# Altium schematic sheet Liniar Power Source.SchDoc
size A4; SheetNumber: 1; SheetTotal: 1
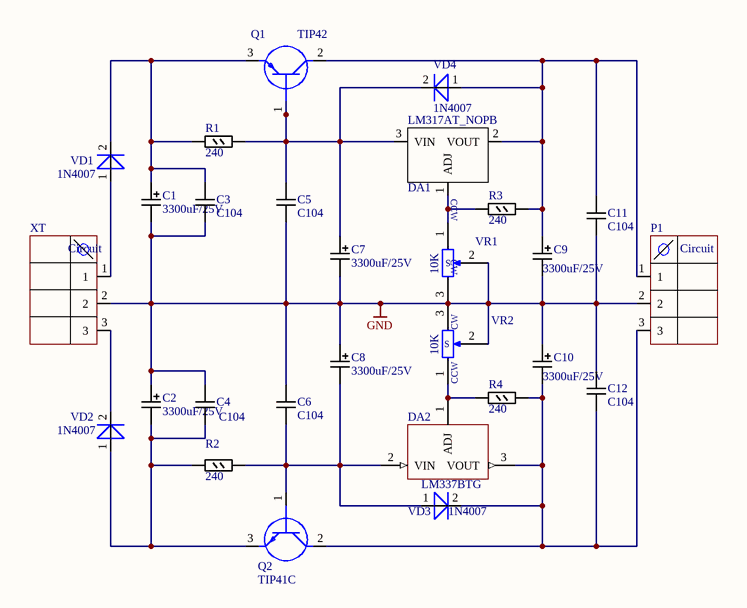
[diagram p0: Liniar Power Source.SchDoc]

## Parts
C1  3300uF/25V  [Cap electrolitic radial 16x25 B]
C2  3300uF/25V  [Cap electrolitic radial 16x25 B]
C3  C104  [CAP CER 5x3x75mm]
C4  C104  [CAP CER 5x3x75mm]
C5  C104  [CAP CER 5x3x75mm]
C6  C104  [CAP CER 5x3x75mm]
C7  3300uF/25V  [Cap electrolitic radial 16x25 B]
C8  3300uF/25V  [Cap electrolitic radial 16x25 B]
C9  3300uF/25V  [Cap electrolitic radial 16x25 B]
C10  3300uF/25V  [Cap electrolitic radial 16x25 B]
C11  C104  [CAP CER 5x3x75mm]
C12  C104  [CAP CER 5x3x75mm]
DA1  LM317AT_NOPB  [TO254P470X1028X1955-3P]
DA2  LM337BTG  [TO254P482X997X2018-3P]
P1  DG350-3.5-3  [DG350-3.5-3]  (value not drawn)
Q1  TIP42  [TO254P483X1010X2035-3P]
Q2  TIP41C  [TO254P483X1010X2035-3P]
R1  240  [RESC2012(0805)N]
R2  240  [RESC2012(0805)N]
R3  240  [RESC2012(0805)N]
R4  240  [RESC2012(0805)N]
VD1  1N4007  [DO-35]
VD2  1N4007  [DO-35]
VD3  1N4007  [DO-35]
VD4  1N4007  [DO-35]
VR1  10K  [P160KN0QC15B50K]
VR2  10K  [P160KN0QC15B50K]
XT  DG350-3.5-3  [DG350-3.5-3]  (value not drawn)

## Nets
GND: C1.2 C2.1 C3.1 C4.2 C5.1 C6.2 C7.2 C8.1 C9.2 C10.1 C11.1 C12.2 P1.2 VR1.3(CW) VR2.3(CW) XT.2
NetC1_1: C1.1 C3.2 Q1.3(E) R1.1 VD1.2
NetC2_2: C2.2 C4.1 Q2.3(E) R2.1 VD2.1
NetC5_2: C5.2 C7.1 DA1.3(VIN) Q1.1(B) R1.2 VD4.2
NetC6_1: C6.1 C8.2 DA2.2(VIN) Q2.1(B) R2.2 VD3.1
NetC9_1: C9.1 C11.2 DA1.2(VOUT) P1.1 Q1.2(C) R3.2 VD4.1
NetC10_2: C10.2 C12.1 DA2.3(VOUT) P1.3 Q2.2(C) R4.2 VD3.2
NetDA1_1: DA1.1(ADJ) R3.1 VR1.1(CCW)
NetDA2_1: DA2.1(ADJ) R4.1 VR2.1(CCW)
NetVD1_1: VD1.1 XT.1
NetVD2_2: VD2.2 XT.3

Not connected (* = marked no-connect by the designer): VR1 2(S); VR2 2(S)

## Notes on the sheet
- (in symbol DG350-3.5-3) Circuit

## Library data of the parts
C1 C2 C7-C10 = Cap electrolitic radial 16x25: Part Number: Cap electrolitic radial 16x25
C3-C6 C11 C12 = CAP CER RADIAL: Part Number: CAP CER RADIAL
DA1 = LM317AT_NOPB: Integrated Circuit; Manufacturer_Name: Texas Instruments; Manufacturer_Part_Number: LM317AT/NOPB; Datasheet Link: http://www.ti.com/lit/gpn/lm317a; Height: 4.7mm; Mouser Part Number: 926-LM317AT/NOPB; Mouser Price/Stock: https://www.mouser.co.uk/ProductDetail/Texas-Instruments/LM317AT-NOPB?qs=X1J7HmVL2ZFYFJRcNgsWcQ%3D%3D; Arrow Part Number: LM317AT/NOPB; Arrow Price/Stock: https://www.arrow.com/en/products/lm317atnopb/texas-instruments; Part Number: LM317AT_NOPB
DA2 = LM337BTG: Integrated Circuit; Manufacturer_Name: ON Semiconductor; Datasheet Link: http://www.onsemi.com/pub/Collateral/LM337-D.PDF; Height: 4.82mm; Manufacturer_Part_Number: LM337BTG; Mouser Part Number: 863-LM337BTG; Mouser Price/Stock: https://www.mouser.co.uk/ProductDetail/ON-Semiconductor/LM337BTG?qs=2OtswVQKCOGoOfwNKxF%2F1w%3D%3D; Arrow Part Number: LM337BTG; Arrow Price/Stock: https://www.arrow.com/en/products/lm337btg/on-semiconductor; Part Number: LM337BTG
Q1 = TIP42: Transistor BJT PNP; Manufacturer_Name: ON Semiconductor; Datasheet Link: http://www.onsemi.com/pub/Collateral/TIP41A-D.PDF; Height: 4.83mm; Manufacturer_Part_Number: TIP42; Mouser Part Number: 512-TIP42; Mouser Price/Stock: https://www.mouser.co.uk/ProductDetail/ON-Semiconductor-Fairchild/TIP42?qs=ljbEvF4DwOPva3Veot79WQ%3D%3D
Q2 = TIP41C: Transistor BJT NPN; Manufacturer_Name: ON Semiconductor; Datasheet Link: http://www.onsemi.com/pub/Collateral/TIP41A-D.PDF; Height: 4.83mm; Manufacturer_Part_Number: TIP41C; Mouser Part Number: 512-TIP41C; Mouser Price/Stock: https://www.mouser.co.uk/ProductDetail/ON-Semiconductor-Fairchild/TIP41C?qs=ljbEvF4DwONP6g8z%252BtNuIA%3D%3D; Arrow Part Number: TIP41C; Arrow Price/Stock: https://www.arrow.com/en/products/tip41c/on-semiconductor
R1-R4 = RESC2012(0805): Part Number: RESC2012(0805); Package: 0805
VD1-VD4 = 1N4148: Small Signal Diode; Part Number: 1N4148
VR1 VR2 = P160KN-0QC15B50K: Variable Resistor; Manufacturer_Name: BI Technologies; Datasheet Link: https://componentsearchengine.com/Datasheets/1/P160KN-0QC15B50K.pdf; Height: 20.75mm; Manufacturer_Part_Number: P160KN-0QC15B50K; Mouser Part Number: 858-P160KN-0QC15B50K; Mouser Price/Stock: https://www.mouser.com/Search/Refine.aspx?Keyword=858-P160KN-0QC15B50K; Arrow Part Number: P160KN-0QC15B50K; Arrow Price/Stock: https://www.arrow.com/en/products/p160kn-0qc15b50k/bi-technologies; Part Number: P160KN-0QC15B50K
P1 XT = DG350-3.5-3: Part Number: DG350-3.5-3